# EAGLE design Adafruit QT Py RP2040 (EAGLE 9.6.2)
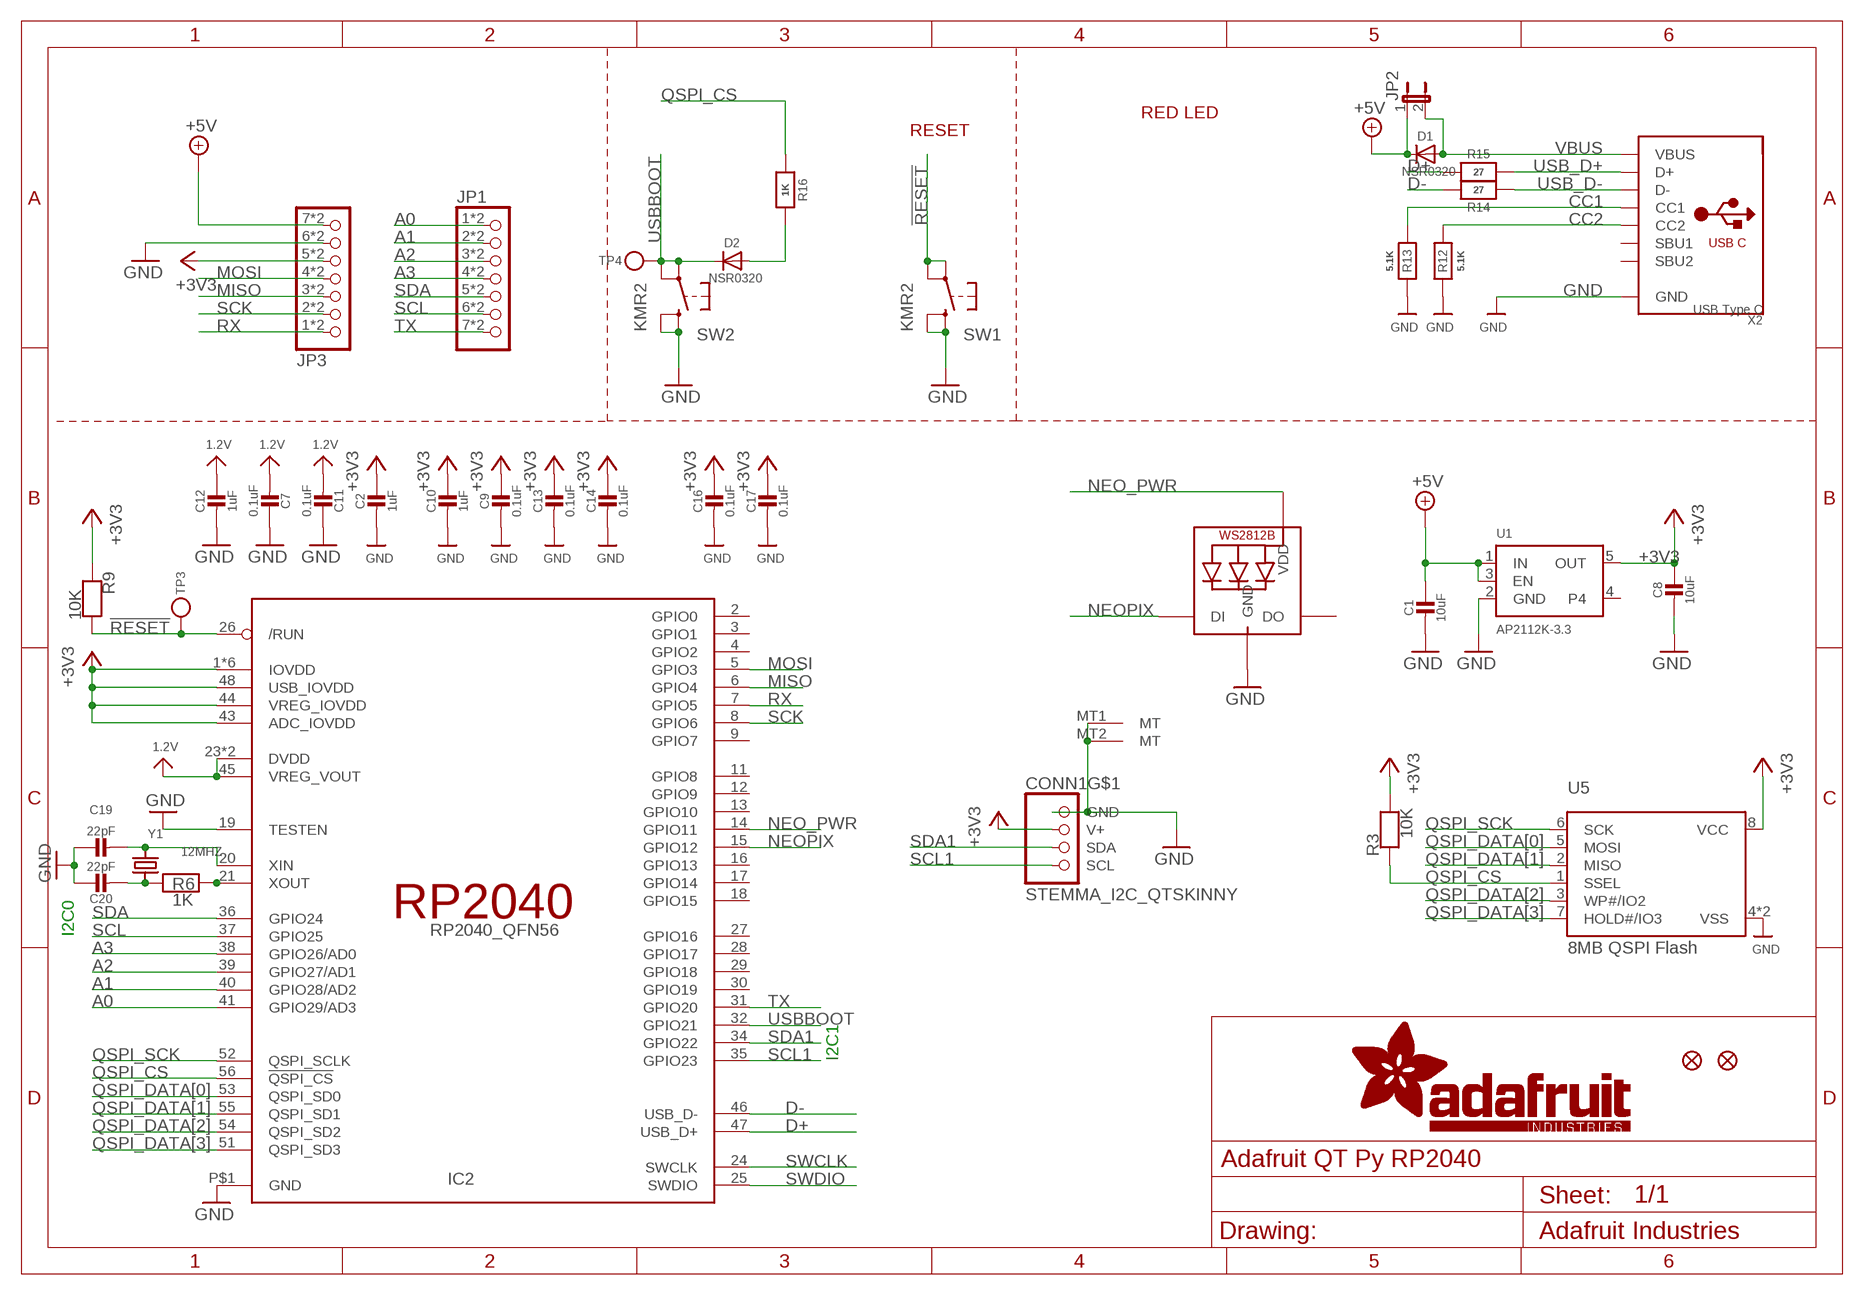
[diagram p0: schematic, sheet 1]

## Parts
C1  10uF  CAP_CERAMIC0805-NOOUTLINE  [0805-NO]
C2  1uF  CAP_CERAMIC0603_NO  [0603-NO]
C7  0.1uF  CAP_CERAMIC_0402NO  [_0402NO]
C8  10uF  CAP_CERAMIC0805-NOOUTLINE  [0805-NO]
C9  0.1uF  CAP_CERAMIC_0402NO  [_0402NO]
C10  1uF  CAP_CERAMIC0603_NO  [0603-NO]
C11  0.1uF  CAP_CERAMIC_0402NO  [_0402NO]
C12  1uF  CAP_CERAMIC0603_NO  [0603-NO]
C13  0.1uF  CAP_CERAMIC_0402NO  [_0402NO]
C14  0.1uF  CAP_CERAMIC_0402NO  [_0402NO]
C16  0.1uF  CAP_CERAMIC_0402NO  [_0402NO]
C17  0.1uF  CAP_CERAMIC_0402NO  [_0402NO]
C19  22pF  CAP_CERAMIC_0402NO  [_0402NO]
C20  22pF  CAP_CERAMIC_0402NO  [_0402NO]
CONN1  STEMMA_I2C_QTSKINNY  [JST_SH4_SKINNY]
D1  NSR0320  DIODE_SOD323MINI  [SOD-323_MINI]
D2  NSR0320  DIODE_SOD323MINI  [SOD-323_MINI]
IC2  RP2040_QFN56  [QFN56_7MM_REDUCEDEPAD]
JP1  HEADER-1X7_CASTEL  [1X07_CASTEL]
JP2  JUMPER-2SMD-NO  [SJ_2S-NO]
JP3  HEADER-1X7_CASTEL  [1X07_CASTEL]
LED1  WS2812B_SK6805_1515  [SK6805_1515]
R3  10K  RESISTOR_0402NO  [_0402NO]
R6  1K  RESISTOR_0402NO  [_0402NO]
R9  10K  RESISTOR_0402NO  [_0402NO]
R12  5.1K  RESISTOR_0402NO  [_0402NO]
R13  5.1K  RESISTOR_0402NO  [_0402NO]
R14  27  RESISTOR_0402NO  [_0402NO]
R15  27  RESISTOR_0402NO  [_0402NO]
R16  1K  RESISTOR_0402NO  [_0402NO]
SW1  KMR2  SWITCH_TACT_SMT4.6X2.8  [BTN_KMR2_4.6X2.8]
SW2  KMR2  SWITCH_TACT_SMT4.6X2.8  [BTN_KMR2_4.6X2.8]
TP3  TESTPOINTROUND1.5MMNO  [TESTPOINT_ROUND_1.5MM_NO]
TP4  TESTPOINTROUND1.5MMNO  [TESTPOINT_ROUND_1.5MM_NO]
U1  AP2112K-3.3  VREG_SOT23-5  [SOT23-5]
U5  8MB QSPI Flash  SPIFLASH_8PIN_4X4  [USON8_4X4]
U$6  FIDUCIAL_1MM  [FIDUCIAL_1MM]
U$8  FIDUCIAL_1MM  [FIDUCIAL_1MM]
X2  USB Type C  USB_C  [USB_C_CUSB31-CFM2AX-01-X]
Y1  12MHZ  CRYSTAL2.5X2.0  [CRYSTAL_2.5X2]

## Nets
1.2V: C7.2 C11.2 C12.1 IC2.23(DVDD) IC2.45(VREG_VOUT) IC2.50(DVDD)
!RESET: IC2.26(/RUN) R9.2 SW1.A'(P1) SW1.A(P) TP3.P$1
+3V3: C2.1 C8.1 C9.1 C10.1 C13.1 C14.1 C16.1 C17.1 CONN1.2(V+) IC2.1(IOVDD) IC2.10(IOVDD) IC2.22(IOVDD) IC2.33(IOVDD) IC2.42(IOVDD) IC2.43(ADC_IOVDD) IC2.44(VREG_IOVDD) IC2.48(USB_IOVDD) IC2.49(IOVDD) JP3.5 JP3.5C R3.2 R9.1 U1.5(OUT) U5.8(VCC)
+5V [power]: C1.1 D1.C JP2.1 JP3.7 JP3.7C U1.1(IN) U1.3(EN)
A0: IC2.41(GPIO29/AD3) JP1.1 JP1.1C
A1: IC2.40(GPIO28/AD2) JP1.2 JP1.2C
A2: IC2.39(GPIO27/AD1) JP1.3 JP1.3C
A3: IC2.38(GPIO26/AD0) JP1.4 JP1.4C
CC1: R13.2 X2.A5(CC1)
CC2: R12.2 X2.B5(CC2)
D+: IC2.47(USB_D+) R15.2
D-: IC2.46(USB_D-) R14.2
GND [power]: C1.2 C2.2 C7.1 C8.2 C9.2 C10.2 C11.1 C12.2 C13.2 C14.2 C16.2 C17.2 C19.1 C20.1 CONN1.1(GND) CONN1.MT1(MT) CONN1.MT2(MT) IC2.19(TESTEN) IC2.P$1(GND) JP3.6 JP3.6C LED1.4(GND) R12.1 R13.1 SW1.B'(S1) SW1.B(S) SW2.B'(S1) SW2.B(S) U1.2(GND) U5.4(VSS) U5.PAD(VSS) X2.A1B12(GND) X2.B1A12(GND)
MISO: IC2.6(GPIO4) JP3.3 JP3.3C
MOSI: IC2.5(GPIO3) JP3.4 JP3.4C
N$1: D2.A R16.2
N$5: C19.2 IC2.20(XIN) Y1.3
N$6: C20.2 R6.1 Y1.1
N$7: IC2.21(XOUT) R6.2
NEO_PWR: IC2.14(GPIO11) LED1.2(VDD)
NEOPIX: IC2.15(GPIO12) LED1.1(DI)
QSPI_CS: IC2.56(!QSPI_CS) R3.1 R16.1 U5.1(SSEL)
QSPI_DATA[0]: IC2.53(QSPI_SD0) U5.5(MOSI)
QSPI_DATA[1]: IC2.55(QSPI_SD1) U5.2(MISO)
QSPI_DATA[2]: IC2.54(QSPI_SD2) U5.3(WP#/IO2)
QSPI_DATA[3]: IC2.51(QSPI_SD3) U5.7(HOLD#/IO3)
QSPI_SCK: IC2.52(QSPI_SCLK) U5.6(SCK)
RX: IC2.7(GPIO5) JP3.1 JP3.1C
SCK: IC2.8(GPIO6) JP3.2 JP3.2C
SCL: IC2.37(GPIO25) JP1.6 JP1.6C
SCL1: CONN1.4(SCL) IC2.35(GPIO23)
SDA: IC2.36(GPIO24) JP1.5 JP1.5C
SDA1: CONN1.3(SDA) IC2.34(GPIO22)
SWCLK: IC2.24(SWCLK)
SWDIO: IC2.25(SWDIO)
TX: IC2.31(GPIO20) JP1.7 JP1.7C
USB_D+: R15.1 X2.A6(D+) X2.B6(D+)
USB_D-: R14.1 X2.A7(D-) X2.B7(D-)
USBBOOT: D2.C IC2.32(GPIO21) SW2.A'(P1) SW2.A(P) TP4.P$1
VBUS [power]: D1.A JP2.2 X2.A4B9(VBUS) X2.B4A9(VBUS)
Unconnected: IC2.2(GPIO0) IC2.3(GPIO1) IC2.4(GPIO2) IC2.9(GPIO7) IC2.11(GPIO8) IC2.12(GPIO9) IC2.13(GPIO10) IC2.16(GPIO13) IC2.17(GPIO14) IC2.18(GPIO15) IC2.27(GPIO16) IC2.28(GPIO17) IC2.29(GPIO18) IC2.30(GPIO19) LED1.3(DO) U1.4 X2.A8(SBU1) X2.B8(SBU2)

## Notes on the sheet
- RED LED
- RESET
- I2C0
- I2C1

## Library data of the parts
C1 C2 C7-C14 C16 C17 C19 C20 = microbuilder:CAP_CERAMIC: Ceramic Capacitors For new designs, use the packages preceded by an '_' character since they are more reliable: The following footprints should be used on most boards: _0402 - Standard footprint for regular board layouts _0603 - Standard footprint for regular board layouts _0805 - Standard footprint for regular board layouts _1206 - Standard footprint for regular board layouts For extremely tight-pitch boards where space is at a premium, the following 'micro-pitch' footprints can be used (smaller pads, no silkscreen outline, etc.): _0402MP - Micro-pitch footprint for very dense/compact boards _0603MP - Micro-pitch footprint for very dense/compact boards _0805MP - Micro-pitch footprint for very dense/compact boards _1206MP - Micro-pitch footprint for very dense/compact boards
CONN1 = microbuilder:STEMMA_I2C
D1 D2 = microbuilder:DIODE: Diode SMA Model Volts Amps Type Vf Ir Digikey # Notes SSA34-E3 40V 3A Schottky 480mV @ 3A 200uA @ 40V SSA34-E3/61TGITR-ND CDBA120-G 20V 1A Schottky 500mV @ 1A 500uA @ 20V 641-1014-6-ND REEL MBRA210 10V 2A Schottky 350mV @ 2A 700uA @ 10V MBRA210LT3 SOD-123 Model Volts Amps Type Vf Ir Order # Notes BAT54T1G 30V 200mA Schottky 800mV @ 200mA 2uA @ 25V BAT54T1GOSTR-ND B0530W 30V 500mA Schottky 430mV @ 500mA 130uA @ 30V B0530W-FDICT-ND REEL MBR120 20V 1A Schottky 340mV @ 1A MBR120VLSFT1GOSCT-ND SOD-323 Model Volts Amps Type Vf Ir Order # Notes PMEG2005EJ 20V 500mA Schottky 355mV @ 500mA 568-4110-1-ND ZLLS410 10V 570mA Schottky 380mV @ 570mA ZLLS410CT-ND 1N4148WS 75V 150mA Silicon/Simple 1V 1N4148WSFSCT-ND REEL SOD-523 Model Volts Amps Type Vf Ir Order # Notes BAT54XV2 30V 200mA Schottky 0.8V @ 100mA BAT54XV2CT-ND TB751S 30V 30mA Schottky RB751S-40TE61CT-ND SOT23-R/W (R = Solder Paste/Reflow Ovens, W = Hand-Soldering) Model Volts Amps Type Vf Ir Order # Notes BAT54FILM 40V 300mA Schottky 497-7162-1-ND POWERDI-5 Model Volts Amps Type Vf Ir Order # Notes PDS560 60V 5A Schottky 670mV @ 5A 150uA @ 60V PDS560DICT-ND
IC2 = adafruit_micro:RP2040
JP1 JP3 = microbuilder:HEADER-1X7: PIN HEADER
JP2 = SparkFun:JUMPER-2: Jumper Basic 0.1" spaced jumper. Use with breakaway headers.
LED1 = microbuilder:WS2812B
R3 R6 R9 R12-R16 = microbuilder:RESISTOR: Resistors For new designs, use the packages preceded by an '_' character since they are more reliable: The following footprints should be used on most boards: _0402 - Standard footprint for regular board layouts _0603 - Standard footprint for regular board layouts _0805 - Standard footprint for regular board layouts _1206 - Standard footprint for regular board layouts For extremely tight-pitch boards where space is at a premium, the following 'micro-pitch' footprints can be used (smaller pads, no silkscreen outline, etc.): _0402MP - Micro-pitch footprint for very dense/compact boards _0603MP - Micro-pitch footprint for very dense/compact boards _0805MP - Micro-pitch footprint for very dense/compact boards _1206MP - Micro-pitch footprint for very dense/compact boards
SW1 SW2 = microbuilder:SWITCH_TACT_SMT: SMT Tact Switches 6x6mm - Digikey: P12940SCT-ND KMR2 (4.6x2.8mm) - Digikey: 401-1426-1-ND EVQ-PQHB55 - Light Touch, 160GF (4.5x4.5mm) - Digikey: P8090SCT-ND KMT0 - KMT021 NGJ LHS (etc.) IP68/Waterproof - Digikey: CKN10289CT-ND
TP3 TP4 = microbuilder:TESTPOINT: Test Point Various test points for characterisation and PCB testing TESTPOINT_SMT - Compact Surface Mount Test Point [Digikey: 5016KTR-ND]
U1 = adafruit_power:VREG_SOT23-5: SOT23-5 Fixed Voltage Regulators Part Current Out V Out V In V Dropout θJA (°C/W) TJ (°C) Digikey Part No. ADP121 150mA 3.3V 3.4-5.5V 0.09V @ 150mA -- -- ADP121-AUJZ33R7CT-ND ADP121 150mA 3.0V 3.1-5.5V 0.09V @ 150mA -- -- ADP121-AUJZ30R7CT-ND ADP122 300mA 3.3V 3.4-5.5V 0.085V @ 300mA -- -- ADP122AUJZ-3.3-R7CT-ND ADP1712 300mA 3.3V 3.5-5.5V 0.17V @ 300mA -- -- ADP1712AUJZ-3.3-R7TR-ND AP7311 (Low Cost) 150mA 3.3V 3.5-6V 0.15V @ 150mA -- -- AP7311-33WG-7DICT-ND LD39015M18R 150mA 1.8V 1.9V-5.5V 0.08V @ 100mA -- -- 497-6977-1-ND LP2985A-33DBVR 150mA 3.3V 3.3-16V 0.28V @ 150mA 206 150 296-18479-1-ND MCP1824T-3302E/OT 300mA 3.3V 3.5V-6V 0.2V @ 300mA -- -- MCP1824T-3302E/OTCT-ND MIC5205-2.5YM5 TR 150mA 2.5V 2.7-16V 0.165V @ 150mA -- -- 576-1257-2-ND MIC5205-3.0YM5 TR 150mA 3.0V 3.2V-16V 0.165V @ 150mA -- -- 576-1258-2-ND MIC5205-3.3YM5 TR 150mA 3.3V 3.5V-16V 0.165V @ 150mA -- -- 576-1259-2-ND TPS780330220 150mA 3.3V+2.2V 3.6-5.5V 250mV Max -- -- 296-23332-1-ND TDA3663/N1,135 100mA 3.3V 3.5-45V 0.18V @ 50mA -- -- 568-5343-1-ND Max operating temp can be calculated using θJA, TJ (max junction temperature), and power in watts. Set the "Maximum Ambient Temperature" until it reaches TJ ("Max Junction Temperature"), which is the absolute limit for safe use of the regulator: Heat Sink Temperature Calculator <http://www.daycounter.com/Calculators/Heat-Sink-Temperature-Calculator.phtml> For example, With 12V source into a 3.3V LP2985 and a 30mA load, we are dissipating (12V-3.3V) * 0.03A = 0.261W. With a θJA of 206 °C/W, a TJ of 150°C, and 261mW we can safely use the chip without a heat sink up to 75°C (=147.1°C Junction Temperature).
U5 = microbuilder:SPIFLASH_8PIN: SOIC8 SPI Flash Be careful with the size since SOIC8 flash comes in several 'widths' SOIC8 150 mil M25P16 - 16Mbit (2Mbit x 8) Serial Flash (75MHz SPI Bus), Supply: 2.7-3.6V Digikey: SOIC8 - M25P16-VMN6P-ND SOIC8 208 mil W25Q16BVSSIG - 16Mbit (2Mbit x 8) Serial Flash (104MHz SPI Bus), Supply: 2.7-3.6V Digikey: SOIC8 - W25Q16BVSSIG-ND
U$6 U$8 = microbuilder:FIDUCIAL: Fiducial Alignment Points Various fiducial points for machine vision alignment.; BOM: EXCLUDE
X2 = microbuilder:USB_C: USB Type-C USB 2.0 Connector
Y1 = microbuilder:CRYSTAL: Crystals HC49UP - Surface Mount Crystal 4.0MHz 18pF +/-30ppm Surface Mount Crystal [Digikey: 535-9857-1-ND] 12.0 MHz Surface Mount Crystal [Digikey: 535-9869-6-ND] 25.0 MHz Surface Mount Crystal [Digikey: 535-9078-1-ND] 2.5 x 2.0mm - MEMs SMT Crystal 16.0 MHz 10pF 20ppm 2.5 x 2.0mm Crystal [Digikey -40-85°C: 535-10923-1-ND] 3.2 x 2.5mm - MEMs SMT Crystal 12.0 MHz 8pF 15ppm 3.2 x 2.5mm Crystal [Digikey: -10-70°C: 644-1047-1-ND -40-125°C: 644-1128-1-ND] 40~85°C cheaper: 644-1173-6-ND 16.0 MHz 8pF 15ppm 3.2 x 2.5mm Crystal [Digikey: -10-70°C: 644-1049-1-ND -40-125°C: 644-1129-2-ND]-40~85°C cheaper: 644-1175-6-ND 16.0 MHz 10pF 10ppm 3.2 x 2.5mm Crystal [Digikey: 644-1100-1-ND] 27.12 MHz 18pF 30ppm 3.2 x 2.5mm Crystal [Digikey: 887-1424-1-ND] 27.12MHz 10pF 10ppm 3.2 x 2.5mm Crystal [Digikey: 887-1329-1-ND] 4.9 x 1.8mm - MEMs SMT Crystal 32.768 KHz 12.5pF 20ppm 4.9 x 1.8mm Crystal [Digikey: SE2415CT-ND] 8.0 x 3.8mm - Surface Mount Crystal 32.768kHz 12.5pF 20ppm -40°C-85°C [Digikey: 535-9166-2-ND] Cylinder 32.768KHz Cylinder Crystal (2x6mm body) [Ex. Digikey: 300-8341-2-ND]

## Net classes
1 power: width 0.305 mm
2 gnd: width 0.254 mm

## Board
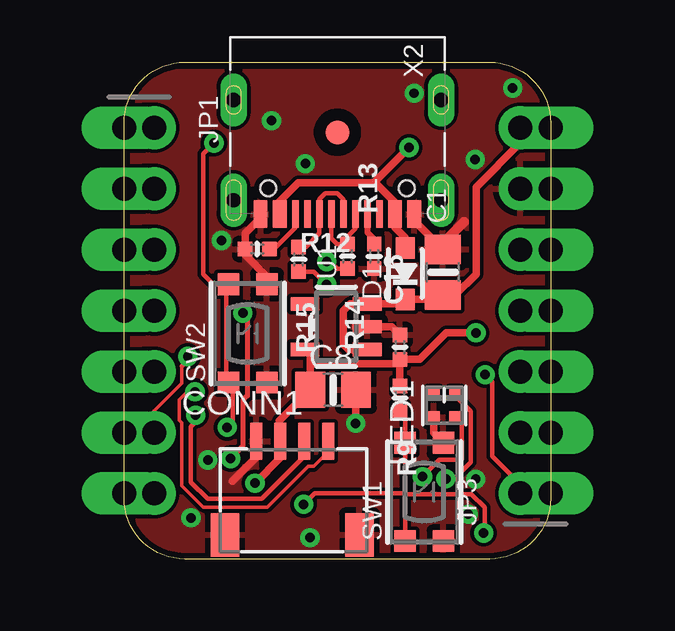
[diagram p1: board, top side]
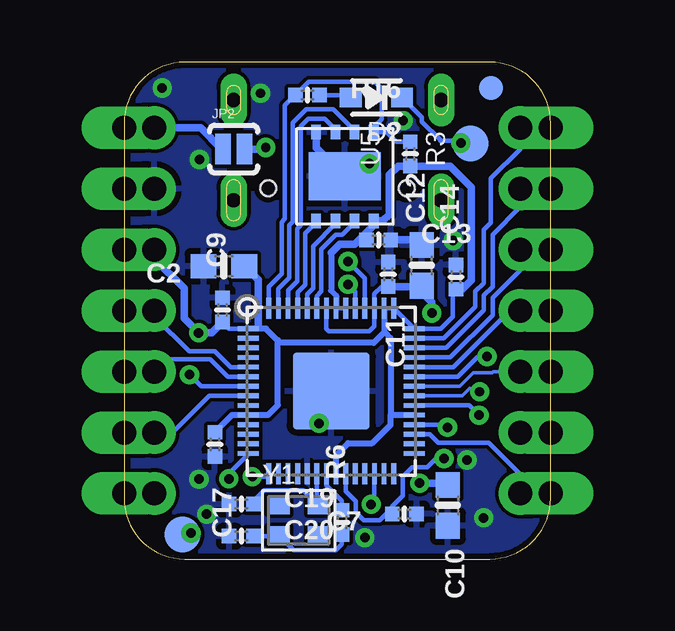
[diagram p2: board, bottom side, seen from below]

Size 17.78 x 20.7 mm. Coordinates in mm from the lower left corner, seen from the top.
Outline: 17.78,18.16 17.78,2.54 arc-90 15.24,0 2.54,0 arc-90 0,2.54 0,18.16 arc-90 2.54,20.7 15.24,20.7 arc-90 17.78,18.16
Copper layers (1*16): Top 0.035mm / dielectric 1.5mm / Bottom 0.035mm
Design rules "adafruit 6-6 *": minimum track width 6mil, minimum drill 15.5mil, track to track 6mil, track to pad 6mil, pad to pad 6mil, via to via 6mil, smd to smd 6mil, copper to edge 10mil, drill to drill 8mil, minimum pad ring 10mil, minimum via ring 8mil, stop-mask expansion 2mil, vias tented up to drill 20mil, thermal gap 10mil

### Footprints (pad centres in the part's own frame; a part is rotated, then mirrored left to right if it is on the bottom)
0805-NO = smd 1.24 x 1.5: 1 -0.95,0; 2 0.95,0
0603-NO = smd 1.075 x 1: 1 -0.85,0; 2 0.85,0
_0402NO = smd 0.6 x 0.6: 1 -0.508,0; 2 0.508,0
JST_SH4_SKINNY = smd 0.5 x 1.55: 1 -1.5,2.514; 2 -0.5,2.514; 3 0.5,2.514; 4 1.5,2.514 | smd 1.2 x 1.8: MT1 -2.8,-1.386; MT2 2.8,-1.386
SOD-323_MINI = smd 0.9 x 0.8: A 1.07,0; C -1.07,0
QFN56_7MM_REDUCEDEPAD = smd 0.875 x 0.2: 1 -3.45,2.6; 2 -3.45,2.2; 3 -3.45,1.8; 4 -3.45,1.4; 5 -3.45,1; 6 -3.45,0.6; 7 -3.45,0.2; 8 -3.45,-0.2; 9 -3.45,-0.6; 10 -3.45,-1; 11 -3.45,-1.4; 12 -3.45,-1.8; 13 -3.45,-2.2; 14 -3.45,-2.6; 29 3.45,-2.6; 30 3.45,-2.2; 31 3.45,-1.8; 32 3.45,-1.4; 33 3.45,-1; 34 3.45,-0.6; 35 3.45,-0.2; 36 3.45,0.2; 37 3.45,0.6; 38 3.45,1; 39 3.45,1.4; 40 3.45,1.8; 41 3.45,2.2; 42 3.45,2.6 | smd 0.2 x 0.875: 15 -2.6,-3.45; 16 -2.2,-3.45; 17 -1.8,-3.45; 18 -1.4,-3.45; 19 -1,-3.45; 20 -0.6,-3.45; 21 -0.2,-3.45; 22 0.2,-3.45; 23 0.6,-3.45; 24 1,-3.45; 25 1.4,-3.45; 26 1.8,-3.45; 27 2.2,-3.45; 28 2.6,-3.45; 43 2.6,3.45; 44 2.2,3.45; 45 1.8,3.45; 46 1.4,3.45; 47 1,3.45; 48 0.6,3.45; 49 0.2,3.45; 50 -0.2,3.45; 51 -0.6,3.45; 52 -1,3.45; 53 -1.4,3.45; 54 -1.8,3.45; 55 -2.2,3.45; 56 -2.6,3.45 | smd 3.2 x 3.2: P$1 0,0
1X07_CASTEL = drill 1 pad 1.778: 1 -7.62,0; 2 -5.08,0; 3 -2.54,0; 4 0,0; 5 2.54,0; 6 5.08,0; 7 7.62,0 | drill 1 pad 1.778 long: 1C -7.62,-1.27; 2C -5.08,-1.27; 3C -2.54,-1.27; 4C 0,-1.27; 5C 2.54,-1.27; 6C 5.08,-1.27; 7C 7.62,-1.27
SJ_2S-NO = smd 0.635 x 1.27: 1 -0.45,0; 2 0.45,0
SK6805_1515 = smd 0.5 x 0.5: 1 -0.5,-0.45; 2 0.5,-0.45; 3 0.5,0.45; 4 -0.5,0.45
BTN_KMR2_4.6X2.8 = smd 0.9 x 0.9: A 2.05,0.8; A' -2.05,0.8; B 2.05,-0.8; B' -2.05,-0.8
TESTPOINT_ROUND_1.5MM_NO = smd 1.5 x 1.5: P$1 0,0
SOT23-5 = smd 0.55 x 1.2: 1 -0.95,-1.3; 2 0,-1.3; 3 0.95,-1.3; 4 0.95,1.3; 5 -0.95,1.3
USON8_4X4 = smd 0.6 x 0.4: 1 -1.85,1.2; 2 -1.85,0.4; 3 -1.85,-0.4; 4 -1.85,-1.2; 5 1.85,-1.2; 6 1.85,-0.4; 7 1.85,0.4; 8 1.85,1.2 | smd 2 x 3: PAD 0,0
FIDUCIAL_1MM = smd 1 x 1: 1 0,0
USB_C_CUSB31-CFM2AX-01-X = smd 0.575 x 1.15: A1B12 -3.2,3.545; A4B9 -2.4,3.545; B1A12 3.2,3.545; B4A9 2.4,3.545 | smd 0.275 x 1.15: A5 -1.25,3.545; A6 -0.25,3.545; A7 0.25,3.545; A8 1.25,3.545; B5 1.75,3.545; B6 0.75,3.545; B7 -0.75,3.545; B8 -1.75,3.545 | drill 0.6 pad 1 long: M1 -4.32,2.97; M2 4.32,2.97; M3 -4.32,-1.21; M4 4.32,-1.21 | hole 0.65: 2.89,2.47; -2.89,2.47
CRYSTAL_2.5X2 = smd 0.9 x 0.75: 1 -0.825,-0.625; 2 0.825,-0.625; 3 0.825,0.625; 4 -0.825,0.625

### Placement (x,y rotation side)
C1  13.28,11.95 90 top
C2  13.61,12.2 180 bottom
C7  6.1,1.88 180 bottom
C8  8.71,7.05 0 top
C9  13.68,10.38 90 bottom
C10  4.29,2.23 270 bottom
C11  6.77,11.86 270 bottom
C12  5.37,12.23 90 bottom
C13  7.18,13.3 0 bottom
C14  3.95,11.75 90 bottom
C16  11.49,8.83 90 top
C17  14,4.78 270 bottom
C19  12.89,2.29 0 bottom
C20  12.89,0.95 0 bottom
CONN1  7.01,2.39 0 top
D1  11.72,11.89 90 top
D2  7.26,19.23 180 bottom
IC2  9.14,7 0 bottom
JP1  1.27,10.35 270 top
JP2  13.21,17.08 0 bottom
JP3  16.51,10.35 90 top
LED1  13.35,6.4 90 top
R3  5.85,16.88 270 bottom
R6  8.7,1.52 90 bottom
R9  11.49,6.71 270 top
R12  5.55,12.92 0 top
R13  10.43,12.61 90 top
R14  9.31,12.61 270 top
R15  7.28,12.48 270 top
R16  10.13,19.33 0 bottom
SW1  12.51,2.79 90 top
SW2  5.16,9.4 90 top
TP3  15.34,1.02 0 bottom
TP4  3.34,17.31 0 bottom
U1  8.84,9.68 90 top
U5  8.57,15.94 270 bottom
U$1  [QTPICO_BOT]  17.78,0.06 0 bottom
U$2  [QTPICO_TOP]  0,0 0 top
U$6  2.49,19.63 0 bottom
U$8  8.89,17.78 0 top
X2  8.89,17.92 180 top
Y1  10.5,1.61 0 bottom

### Tracks (layer width: path | path; a pad name or v marks a point on that pad's centre or on a via)
1.2V  (via drill 0.39)
  Top 0.203: v4.44,4.19 4.95,4.7 4.95,6.6 5.14,6.79 5.14,10.06 v4.95,10.25
  Bottom 0.178: IC2.50 9.34,9.59 9.25,9.49 7.56,9.49 7.34,9.7 IC2.45 7.34,11.06 7.05,11.35 C11.2 5.4,11.35 C12.1 | v4.44,4.19 4.77,4.19 5.14,3.82 5.77,3.82 6.16,3.43 6.16,2.64 6.6,2.2 C7.2 6.86,1.88 7.11,1.62 7.8,1.62 8.13,1.95 8.13,2.41 8.54,2.83 IC2.23
  Bottom 0.305: v4.95,10.25 4.95,10.71 5.6,11.35 C11.2 6.74,11.35
!RESET  (via drill 0.39)
  Top 0.178: 11.71,2.82 11.62,2.73 7.94,2.73 v7.48,2.28 | 11.71,2.82 SW1.A 11.71,5.98 R9.2 | 11.71,2.82 11.71,2.7 | 11.71,2.7 SW1.A' | v14.99,1.08 15.02,1.12 15.02,2.15 14.47,2.7 11.71,2.7
  Bottom 0.178: IC2.26 7.34,2.42 v7.48,2.28 | v14.99,1.08 15.28,1.08 TP3.P$1
+3V3  (via drill 0.39)
  Top 0.305: v5.46,3.16 6.51,4.21 CONN1.2 6.48,4.93 6.48,5.46 | 6.51,5.43 6.48,5.46 | U1.5 7.76,8.5 7.76,8.13 | 7.76,8.13 C8.1 6.48,5.76 6.48,5.46 | 7.76,8.13 11.3,8.13 C16.1 | v14.67,9.42 13.42,9.42 12.31,8.32 C16.1 | C16.1 R9.1
  Bottom 0.178: IC2.44 6.92,10.45 IC2.43 IC2.42 4.58,9.6 4.09,10.09 4.09,11.1 C14.1 | IC2.49 IC2.48 | 11.42,9.14 11.37,9.14 11.37,9.13 | C9.1 13.41,9.6 IC2.1 | C13.1 7.68,13.4 7.78,13.5
  Bottom 0.203: 9.15,11.18 8.94,10.98
  Bottom 0.254: 6.92,9.46 7.38,9 11.37,9 | 6.92,9.46 6.92,10.45 | 6.92,9.46 6.67,9.21 6.67,6 | IC2.22 8.94,4.33 8.45,4.83 7.43,4.83 6.67,5.59 6.67,6 | 11.42,9.14 11.87,9.6 IC2.1 12.27,9.6 12.19,9.68 | 11.37,9 11.37,6.41 11.78,6 IC2.10 13.28,6 C17.1 | 11.37,9 11.37,9.13 | C14.1 3.95,11.34 | IC2.33 6.67,6 | 9.15,12.76 9.15,11.18 | 8.94,10.98 IC2.49
  Bottom 0.305: JP3.5C JP3.5 16.51,12.51 15.28,11.28 15.28,10.03 v14.67,9.42 14.12,9.42 C9.1 | v5.46,3.16 4.37,3.16 C10.1 | 9.15,12.76 8.8,13.11 8.17,13.11 7.78,13.5 7.37,13.91 U5.8 6.99,14.09 6.73,14.35 6.73,15.15 6.73,16 6.36,16.37 R3.2 | C14.1 3.68,11.24 3.3,11.62 3.3,15.49 4.18,16.37 R3.2 | R3.2 5.78,16.45 5.69,16.36 | C2.1 12.19,11.63 12.19,9.68
+5V
  Top 0.305: JP3.7 16.51,17.34 14.67,15.49 14.67,11.87 13.79,11 C1.1 13.1,10.82 D1.C 11.72,10.63 U1.3 9.42,10.63 9.14,10.35 9.14,8.95 9.37,8.73 U1.1
  Bottom 0.305: JP3.7 JP3.7C 14.59,17.97 13.7,17.08 JP2.1
A0
  Bottom 0.178: IC2.41 4.46,9.2 3.14,10.52 3.14,11.15 2.79,11.49 2.79,13.72 2.49,14.02 2.49,15.86 1.27,17.08 JP1.1 JP1.1C
A1
  Top 0.178: JP1.2C JP1.2
  Bottom 0.178: IC2.40 4.35,8.8 2.78,10.37 2.78,11 2.43,11.35 2.43,13.51 1.27,14.67 JP1.2
A2
  Top 0.178: JP1.3C JP1.3
  Bottom 0.178: IC2.39 4.19,8.4 2.43,10.17 2.43,10.88 1.27,12.04 JP1.3
A3
  Top 0.178: JP1.4C JP1.4
  Bottom 0.178: IC2.38 4.05,8 1.7,10.35 JP1.4
CC1
  Top 0.178: 10.43,13.32 R13.2
  Top 0.254: X2.A5 10.14,13.61 10.43,13.32
CC2
  Top 0.178: X2.B5 7.14,13.81 6.25,12.92 R12.2
D+  (via drill 0.39)
  Top 0.178: v8.45,11.44 7.91,11.98 R15.2
  Bottom 0.178: IC2.47 8.14,11.14 v8.45,11.44
D-  (via drill 0.39)
  Top 0.178: R14.2 8.89,12.1 8.6,12.4 v8.45,12.4
  Bottom 0.178: IC2.46 7.74,11.7 v8.45,12.4
GND  (via drill 0.39)
  Top 0.305: SW2.B 5.96,11.77 5.04,12.68 R12.1 5.04,13.56 5.69,14.21 X2.B1A12 | CONN1.1 5.51,4.24 4.51,3.24 | C8.2 9.66,5.66 v9.65,5.65 | LED1.4 12.9,5.26 SW1.B | X2.A1B12 12.09,14.1 C1.2 | U1.2 11.15,9.68 C16.2
  Top 0.406: 13.53,13.4 14.16,14.03
  Bottom 0.305: JP3.6C JP3.6 | 9.14,7.21 IC2.P$1 9.65,6.49 v9.65,5.65 | U5.4 9.77,17.14 U5.PAD 8.04,16.47 v7.56,16.47 | C13.2 5.59,13.3 C12.2
  other vias: 2.79,1.71 7.75,0.89 14.34,1.87 3.49,4.13 14.66,3.33 4.06,13.27 16.19,19.62 12.09,19.41 14.63,16.65 6.15,18.26
  pour Top: 0,20.32 17.78,20.32 17.78,0 0,0
  pour Bottom: 0,20.78 17.78,20.78 17.78,0 0,0
MISO
  Bottom 0.178: IC2.6 13.46,7.6 14.18,8.32 16,8.32 JP3.3 JP3.3C
MOSI
  Bottom 0.178: IC2.5 13.33,8 13.99,8.66 15.07,8.66 16.51,10.1 JP3.4 JP3.4C
N$1
  Bottom 0.178: D2.A 8.44,19.33 R16.2
N$5
  Bottom 0.178: IC2.20 9.74,2.54 9.68,2.58 Y1.3 10.31,2.87 11.94,2.87 12.38,2.42 C19.2
N$6
  Bottom 0.178: R6.1 8.7,0.62 8.95,0.37 10.71,0.37 Y1.1 11.33,0.95 C20.2
N$7
  Bottom 0.178: IC2.21 9.34,3.07 8.7,2.43 R6.2
NEO_PWR  (via drill 0.39)
  Top 0.178: LED1.2 13.8,6.81 14.44,6.16 14.44,4.03 13.75,3.34 v13.41,3.34
  Bottom 0.178: IC2.14 12.59,4.36 13.41,3.54 v13.41,3.34
NEOPIX  (via drill 0.39)
  Top 0.178: LED1.1 14.06,5.63 14.06,4.13 13.13,4.13 v12.43,3.43
  Bottom 0.178: IC2.15 11.86,3.43 v12.43,3.43
QSPI_CS
  Bottom 0.178: IC2.56 11.74,11.35 11.22,11.88 11.22,14.04 11.07,14.18 11.07,18.9 R16.1 10.09,19.88 7.33,19.88 7.05,19.6 7.05,18.33 7.37,18 U5.1 | 7.41,17.83 U5.1 | R3.1 6.44,17.39 6.84,17.79 U5.1
QSPI_DATA[0]
  Bottom 0.178: U5.5 9.77,14.03 10.22,13.57 10.22,11.43 10.54,11.11 IC2.53
QSPI_DATA[1]
  Bottom 0.178: U5.2 8.17,17.84 9.06,18.73 10.18,18.73 10.74,18.17 10.74,14.04 10.88,13.9 10.88,11.72 11.34,11.26 IC2.55
QSPI_DATA[2]
  Bottom 0.178: IC2.54 10.94,11.19 10.55,11.58 10.55,13.77 10.41,13.91 10.41,18.03 10.1,18.35 9.42,18.35 8.97,17.91 U5.3
QSPI_DATA[3]
  Bottom 0.178: U5.7 8.17,14.04 8.69,13.52 8.95,13.52 9.55,12.91 9.55,11.15 9.74,10.96 IC2.51
QSPI_SCK
  Bottom 0.178: U5.6 8.97,13.96 9.89,13.04 9.89,11.28 10.14,11.03 IC2.52
RX  (via drill 0.39)
  Top 0.178: JP3.1C JP3.1 16.51,3.11 15.34,4.28 15.34,7.39 v15.05,7.68
  Bottom 0.178: IC2.7 14.57,7.2 v15.05,7.68
SCK
  Bottom 0.178: IC2.8 14.23,6.8 15.76,5.27 JP3.2 JP3.2C
SCL  (via drill 0.39)
  Top 0.152: 2.41,8.04 2.41,7.32 1.27,6.18 1.27,6.16
  Top 0.178: v2.65,8.43 2.73,8.36 2.41,8.04 | 1.27,6.16 JP1.6 JP1.6C
  Bottom 0.178: IC2.37 3.88,7.6 3.04,8.43 v2.65,8.43
SCL1  (via drill 0.39)
  Top 0.152: CONN1.4 8.51,4.46 7.91,3.86 7.67,3.86 5.97,2.16 3.3,2.16 2.41,3.05 2.41,5.67 2.3,5.78 2.3,6.64 2.63,6.97 v2.96,6.97
  Bottom 0.152: IC2.35 3.68,6.8 3.37,7.11 3.19,6.94 3.1,6.94 3.07,6.97 v2.96,6.97
SDA
  Top 0.178: JP1.5C JP1.5
  Bottom 0.152: IC2.36 3.79,7.2 3.22,7.77 2.43,7.77 2.39,7.81 JP1.5
SDA1  (via drill 0.39)
  Top 0.178: v2.98,5.99 2.98,5.71 2.78,5.51 2.78,3.21 3.48,2.5 5.74,2.5 7.56,4.32 7.56,4.86 CONN1.3
  Bottom 0.178: IC2.34 3.39,6.4 v2.98,5.99
TX
  Top 0.178: JP1.7C JP1.7
  Bottom 0.178: JP1.7 1.27,3.54 2.58,4.84 4.69,4.84 5.05,5.2 IC2.31
USB_D+
  Top 0.178: R15.1 7.57,12.99 8.14,13.56 X2.B6 8.13,14.38 8.13,14.99 8.38,15.24 8.89,15.24 9.14,14.99 X2.A6
USB_D-
  Top 0.178: X2.B7 9.64,13.77 9.31,13.44 R14.1 8.89,13.12 8.64,13.37 X2.A7
USBBOOT  (via drill 0.39)
  Top 0.178: v4.3,5.48 4.53,5.72 4.53,7.17 SW2.A' 4.25,7.45 4.25,11.35 SW2.A 3.73,11.45 3.3,11.87 3.3,16.89 v3.75,17.34
  Bottom 0.178: IC2.32 4.41,5.6 v4.3,5.48 | TP4.P$1 3.47,17.44 4.61,17.44 4.61,17.47 5.37,18.22 5.37,18.4 D2.C
  Bottom 0.203: TP4.P$1 3.37,17.34 v3.75,17.34
VBUS  (via drill 0.39)
  Top 0.305: D1.A 11.72,13.39 11.29,13.82 X2.A4B9 11.29,14.87 10.48,15.68 | X2.B4A9 6.47,14.4 6.47,14.88 7.27,15.68 10.47,15.68 10.48,15.68 | v11.87,17.14 10.48,15.75 10.48,15.68
  Bottom 0.305: JP2.2 11.94,17.08 v11.87,17.14